# EAGLE design WM-main board1finalRev5_1 (EAGLE 7.5.0)
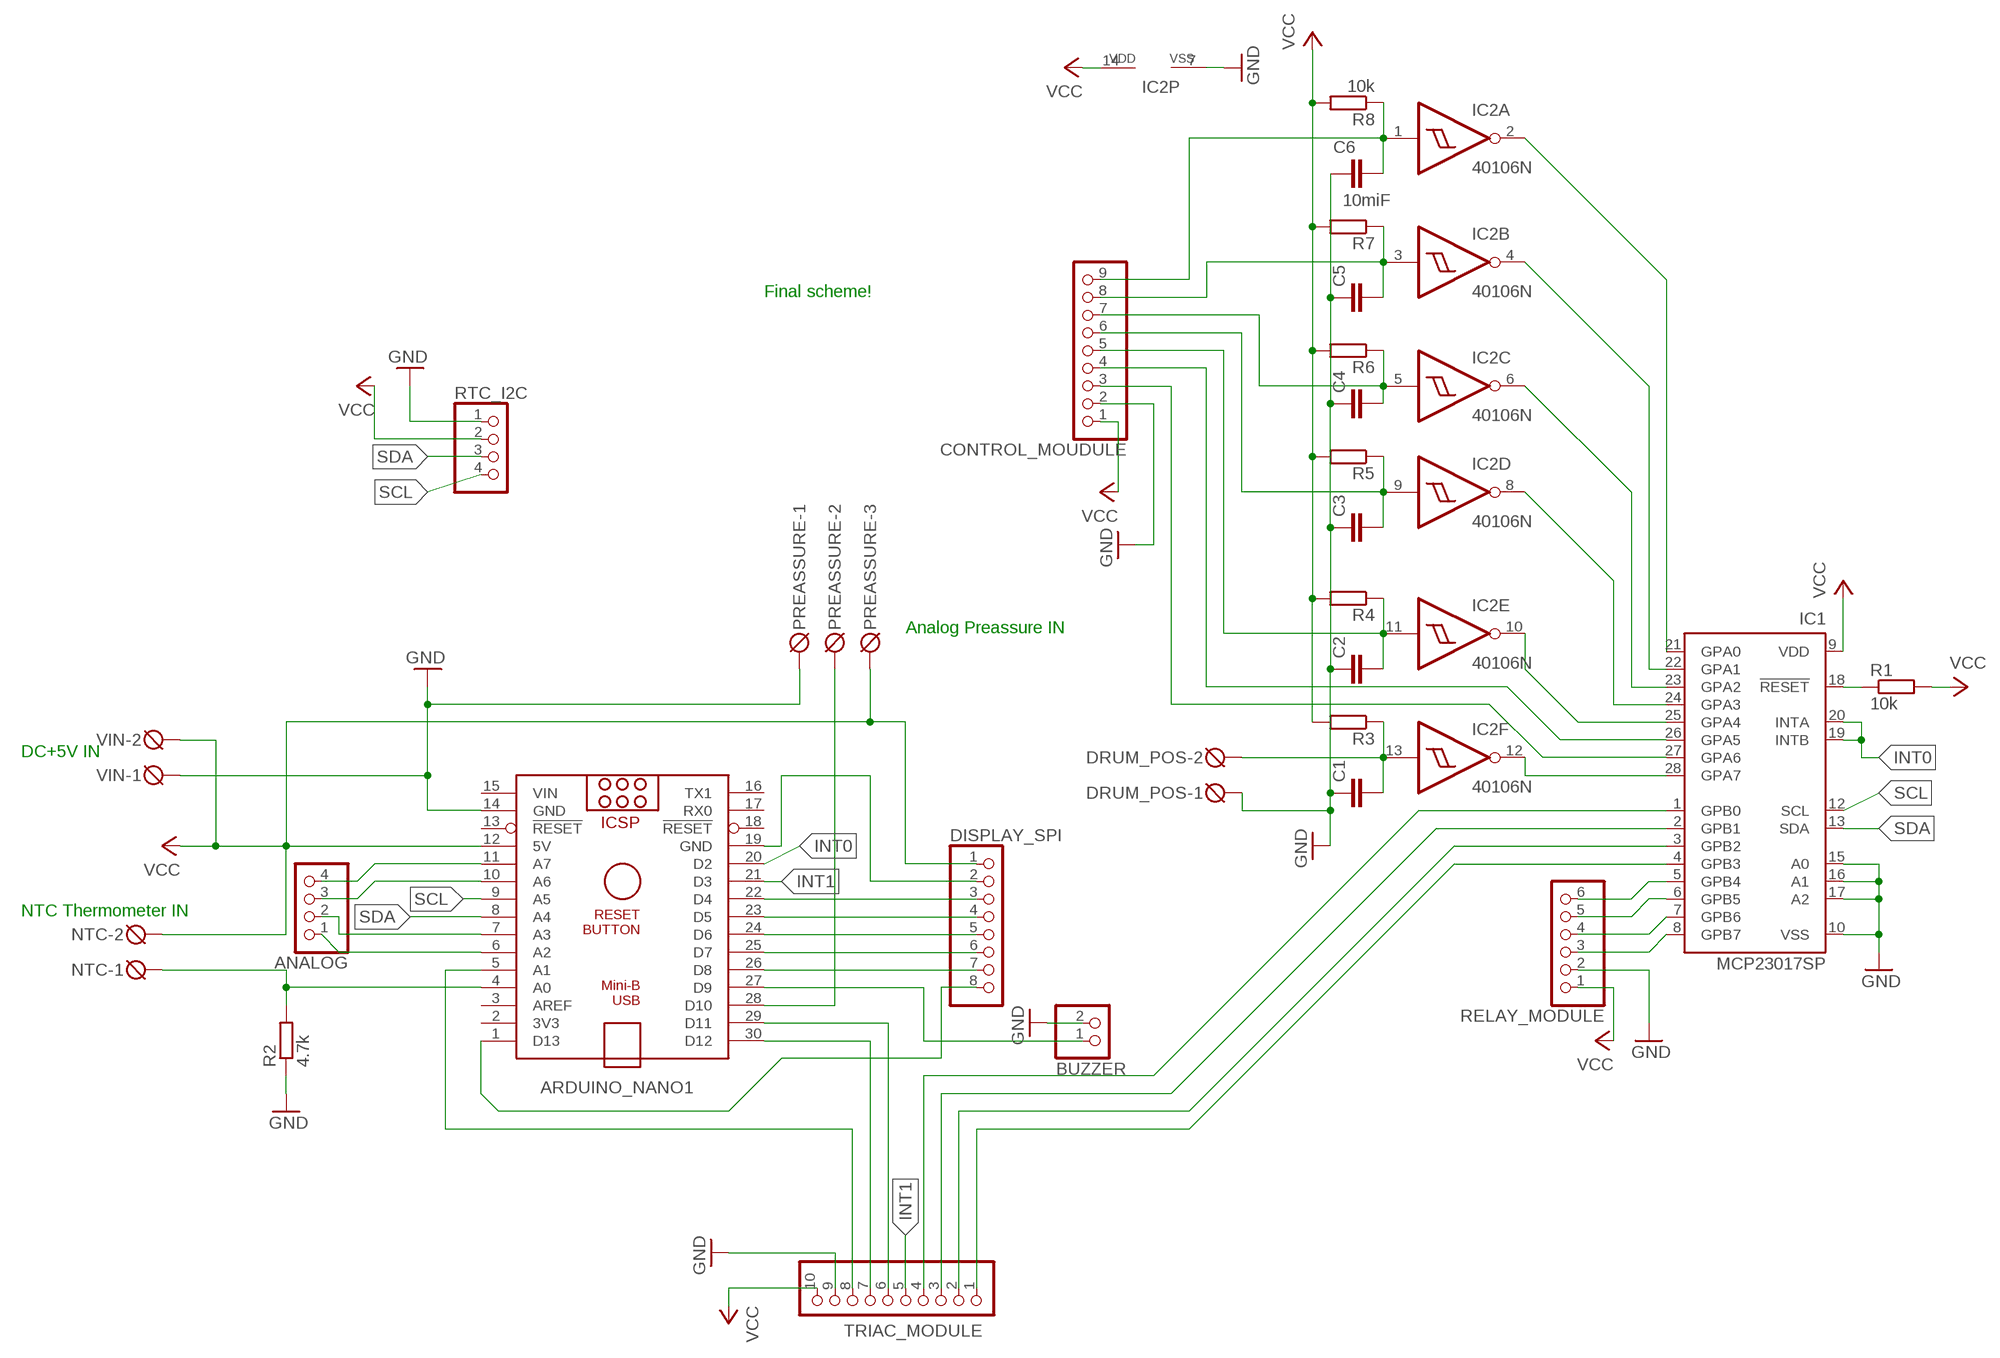
[diagram p0: schematic, sheet 1]

## Parts
ANALOG  PINHD-1X4  [1X04]
ARDUINO_NANO1  ARDUINO_NANO  [ARDUINO_NANO]
BUZZER  PINHD-1X2  [1X02]
C1  CC1206  [C1206]
C2  CC1206  [C1206]
C3  CC1206  [C1206]
C4  CC1206  [C1206]
C5  CC1206  [C1206]
C6  10miF  CC1206  [C1206]
CONTROL_MOUDULE  PINHD-1X9  [1X09-BIG]
DISPLAY_SPI  PINHD-1X8BIG  [1X08-BIG]
DRUM_POS  DRUM  DG3XX-02-5.0  [DG306-5.0-02P]
IC1  MCP23017SP  [DIL28-3]
IC2  40106N  [DIL14]
NTC  TEMP  DG3XX-02-5.0  [DG306-5.0-02P]
PREASSURE  GND D10 +5V(out)  DG3XX-03-5.0  [DG306-5.0-03P]
R1  10k  R-EU_0204/7  [0204/7]
R2  4.7k  R-EU_0204/7  [0204/7]
R3  R-EU_M1206  [M1206]
R4  R-EU_M1206  [M1206]
R5  R-EU_M1206  [M1206]
R6  R-EU_M1206  [M1206]
R7  R-EU_M1206  [M1206]
R8  10k  R-EU_M1206  [M1206]
RELAY_MODULE  PINHD-1X6B  [1X06-BIG]
RTC_I2C  PINHD-1X4  [1X04]
TRIAC_MODULE  PINHD-1X10  [1X10-BIG]
VIN  GND +5V(IN)  DG3XX-02-5.0  [DG306-5.0-02P]

## Nets
GND: ARDUINO_NANO1.14(GND) BUZZER.2 C1.1 C2.1 C3.1 C4.1 C5.1 C6.1 CONTROL_MOUDULE.2 DRUM_POS.1 IC1.10(VSS) IC1.15(A0) IC1.16(A1) IC1.17(A2) IC2.7(P:VSS) PREASSURE.1 R2.1 RELAY_MODULE.2 RTC_I2C.1 TRIAC_MODULE.9 VIN.1
INT0: ARDUINO_NANO1.20(D2) IC1.19(INTB) IC1.20(INTA)
INT1: ARDUINO_NANO1.21(D3) TRIAC_MODULE.5
N$1: IC1.18(!RESET) R1.1
N$2: ARDUINO_NANO1.4(A0) NTC.1 R2.2
N$3: IC1.21(GPA0) IC2.2(A:O)
N$4: IC1.22(GPA1) IC2.4(B:O)
N$5: ARDUINO_NANO1.28(D10) PREASSURE.2
N$6: IC1.23(GPA2) IC2.6(C:O)
N$7: IC1.24(GPA3) IC2.8(D:O)
N$8: IC1.25(GPA4) IC2.10(E:O)
N$9: IC1.28(GPA7) IC2.12(F:O)
N$10: C1.2 DRUM_POS.2 IC2.13(F:I) R3.1
N$11: C2.2 CONTROL_MOUDULE.5 IC2.11(E:I) R4.1
N$12: C3.2 CONTROL_MOUDULE.6 IC2.9(D:I) R5.1
N$13: C4.2 CONTROL_MOUDULE.7 IC2.5(C:I) R6.1
N$14: C5.2 CONTROL_MOUDULE.8 IC2.3(B:I) R7.1
N$15: C6.2 CONTROL_MOUDULE.9 IC2.1(A:I) R8.1
N$16: ANALOG.1 ARDUINO_NANO1.6(A2)
N$17: ARDUINO_NANO1.27(D9) BUZZER.1
N$18: ARDUINO_NANO1.26(D8) DISPLAY_SPI.7
N$19: ARDUINO_NANO1.25(D7) DISPLAY_SPI.6
N$20: ARDUINO_NANO1.24(D6) DISPLAY_SPI.5
N$21: ARDUINO_NANO1.23(D5) DISPLAY_SPI.4
N$22: CONTROL_MOUDULE.4 IC1.26(GPA5)
N$23: ARDUINO_NANO1.22(D4) DISPLAY_SPI.3
N$24: ARDUINO_NANO1.19(GND) DISPLAY_SPI.2
N$25: CONTROL_MOUDULE.3 IC1.27(GPA6)
N$26: IC1.6(GPB5) RELAY_MODULE.5
N$27: ARDUINO_NANO1.29(D11) TRIAC_MODULE.6
N$28: IC1.7(GPB6) RELAY_MODULE.4
N$29: IC1.8(GPB7) RELAY_MODULE.3
N$30: ANALOG.2 ARDUINO_NANO1.7(A3)
N$31: IC1.4(GPB3) TRIAC_MODULE.1
N$32: IC1.1(GPB0) TRIAC_MODULE.4
N$33: IC1.2(GPB1) TRIAC_MODULE.3
N$34: IC1.3(GPB2) TRIAC_MODULE.2
N$36: ARDUINO_NANO1.30(D12) TRIAC_MODULE.7
N$37: ANALOG.3 ARDUINO_NANO1.10(A6)
N$38: ANALOG.4 ARDUINO_NANO1.11(A7)
N$39: IC1.5(GPB4) RELAY_MODULE.6
N$43: ARDUINO_NANO1.1(D13) DISPLAY_SPI.8
N$52: ARDUINO_NANO1.5(A1) TRIAC_MODULE.8
SCL: ARDUINO_NANO1.9(A5) IC1.12(SCL) RTC_I2C.4
SDA: ARDUINO_NANO1.8(A4) IC1.13(SDA) RTC_I2C.3
VCC: ARDUINO_NANO1.12(5V) CONTROL_MOUDULE.1 DISPLAY_SPI.1 IC1.9(VDD) IC2.14(P:VDD) NTC.2 PREASSURE.3 R1.2 R3.2 R4.2 R5.2 R6.2 R7.2 R8.2 RELAY_MODULE.1 RTC_I2C.2 TRIAC_MODULE.10 VIN.2
Unconnected: ARDUINO_NANO1.2(3V3) ARDUINO_NANO1.3(AREF) ARDUINO_NANO1.13(!RESET) ARDUINO_NANO1.16(TX1) ARDUINO_NANO1.17(RX0) ARDUINO_NANO1.18(!RESET)

## Notes on the sheet
- Final scheme!
- Analog Preassure IN
- DC+5V IN
- NTC Thermometer IN

## Power pins joined to a net without a drawn wire
VIN: ARDUINO_NANO1.15(VIN)

## Library data of the parts
ANALOG RTC_I2C = pinhead:PINHD-1X4: PIN HEADER
ARDUINO_NANO1 = ArduinoNanoV30:ARDUINO_NANO: Arduino Nano V3.0 Overview: The Arduino Nano is a small, complete, and breadboard-friendly board based on the ATmega328 (Arduino Nano 3.x) or ATmega168 (Arduino Nano 2.x). It has more or less the same functionality of the Arduino Duemilanove, but in a different package. It lacks only a DC power jack, and works with a Mini-B USB cable instead of a standard one. The Nano was designed and is being produced by Gravitech. Specifications: Microcontroller Atmel ATmega168 or ATmega328 Operating Voltage (logic level) 5 V Input Voltage (recommended) 7-12 V Input Voltage (limits) 6-20 V Digital I/O Pins 14 (of which 6 provide PWM output) Analog Input Pins 8 DC Current per I/O Pin 40 mA Flash Memory 16 KB (ATmega168) or 32 KB (ATmega328) of which 2 KB used by bootloader SRAM 1 KB (ATmega168) or 2 KB (ATmega328) EEPROM 512 bytes (ATmega168) or 1 KB (ATmega328) Clock Speed 16 MHz Dimensions 0.73" x 1.70" Length 45 mm Width 18 mm Weigth 5 g Power: The Arduino Nano can be powered via the Mini-B USB connection, 6-20V unregulated external power supply (pin 30), or 5V regulated external power supply (pin 27). The power source is automatically selected to the highest voltage source. Memory: The ATmega168 has 16 KB of flash memory for storing code (of which 2 KB is used for the bootloader); the ATmega328 has 32 KB, (also with 2 KB used for the bootloader). The ATmega168 has 1 KB of SRAM and 512 bytes of EEPROM (which can be read and written with the EEPROM library); the ATmega328 has 2 KB of SRAM and 1 KB of EEPROM. Input and Output: Each of the 14 digital pins on the Nano can be used as an input or output, using pinMode(), digitalWrite(), and digitalRead() functions. They operate at 5 volts. Each pin can provide or receive a maximum of 40 mA and has an internal pull-up resistor (disconnected by default) of 20-50 kOhms. In addition, some pins have specialized functions. Visit Arduino - ArduinoBoardNano <https://www.arduino.cc/en/Main/ArduinoBoardNano>
BUZZER = pinhead:PINHD-1X2: PIN HEADER
C1-C6 = eagle-ltspice:C: CAPACITOR, European symbol; SPICEMODEL: NONE; SPICEPREFIX: C
CONTROL_MOUDULE = adafruit:PINHD-1X9: Pin header 1x10 0.1" spacing With round pins
DISPLAY_SPI = adafruit:PINHD-1X8: PIN HEADER
DRUM_POS NTC VIN = degson:DG3XX-02: DG350-3.5-02P DG306-5.0-02P
IC1 = adafruit:MCP23017: http://ww1.microchip.com/downloads/en/DeviceDoc/21952a.pdf Source: http://ww1.microchip.com/downloads/en/DeviceDoc/21952a.pdf
IC2 = 40xx:40106: Hex SCHMITT TRIGGER
PREASSURE = degson:DG3XX-03: DG350-3.5-03P DG306-5.0-03P
R1-R8 = resistor:R-EU_: RESISTOR, European symbol
RELAY_MODULE = adafruit:PINHD-1X6: PIN HEADER
TRIAC_MODULE = adafruit:PINHD-1X10: Pin header 1x10 0.1" spacing With round pins

## Net classes
0 default: width 0.762 mm, drill 0.254 mm, clearance 0.508 mm
1 silnější: width 1.016 mm, drill 0.305 mm, clearance 0.635 mm

## Board
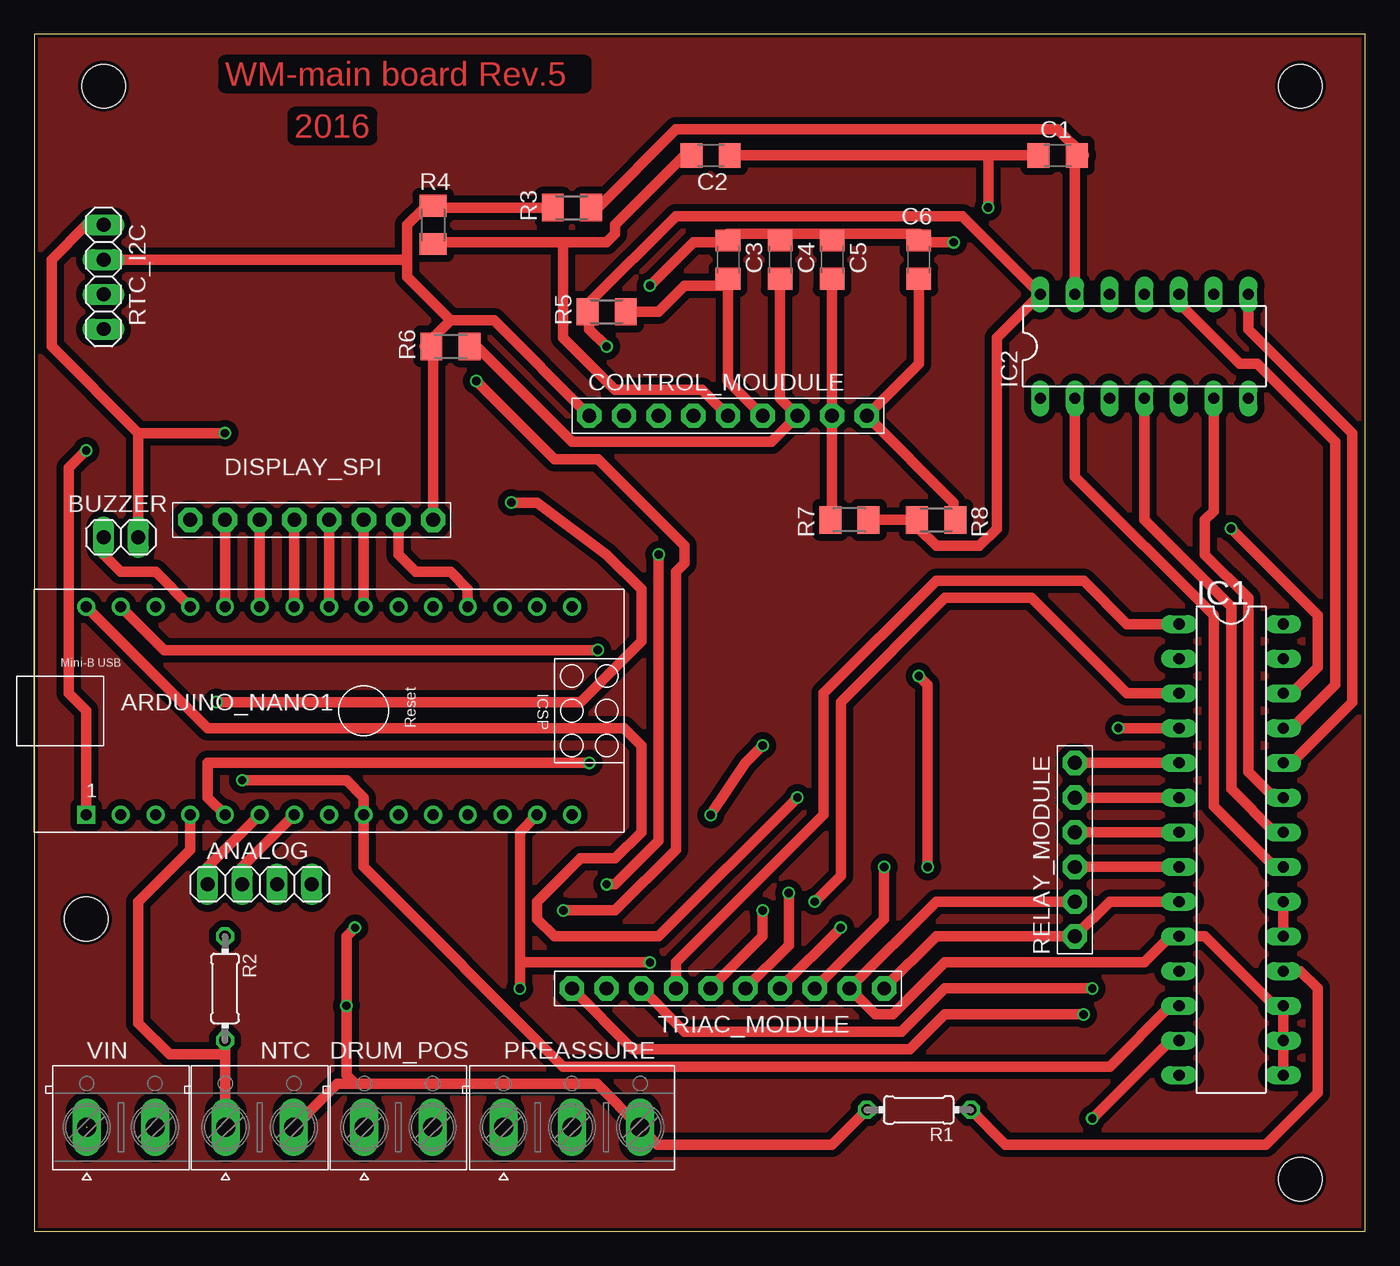
[diagram p1: board, top side]
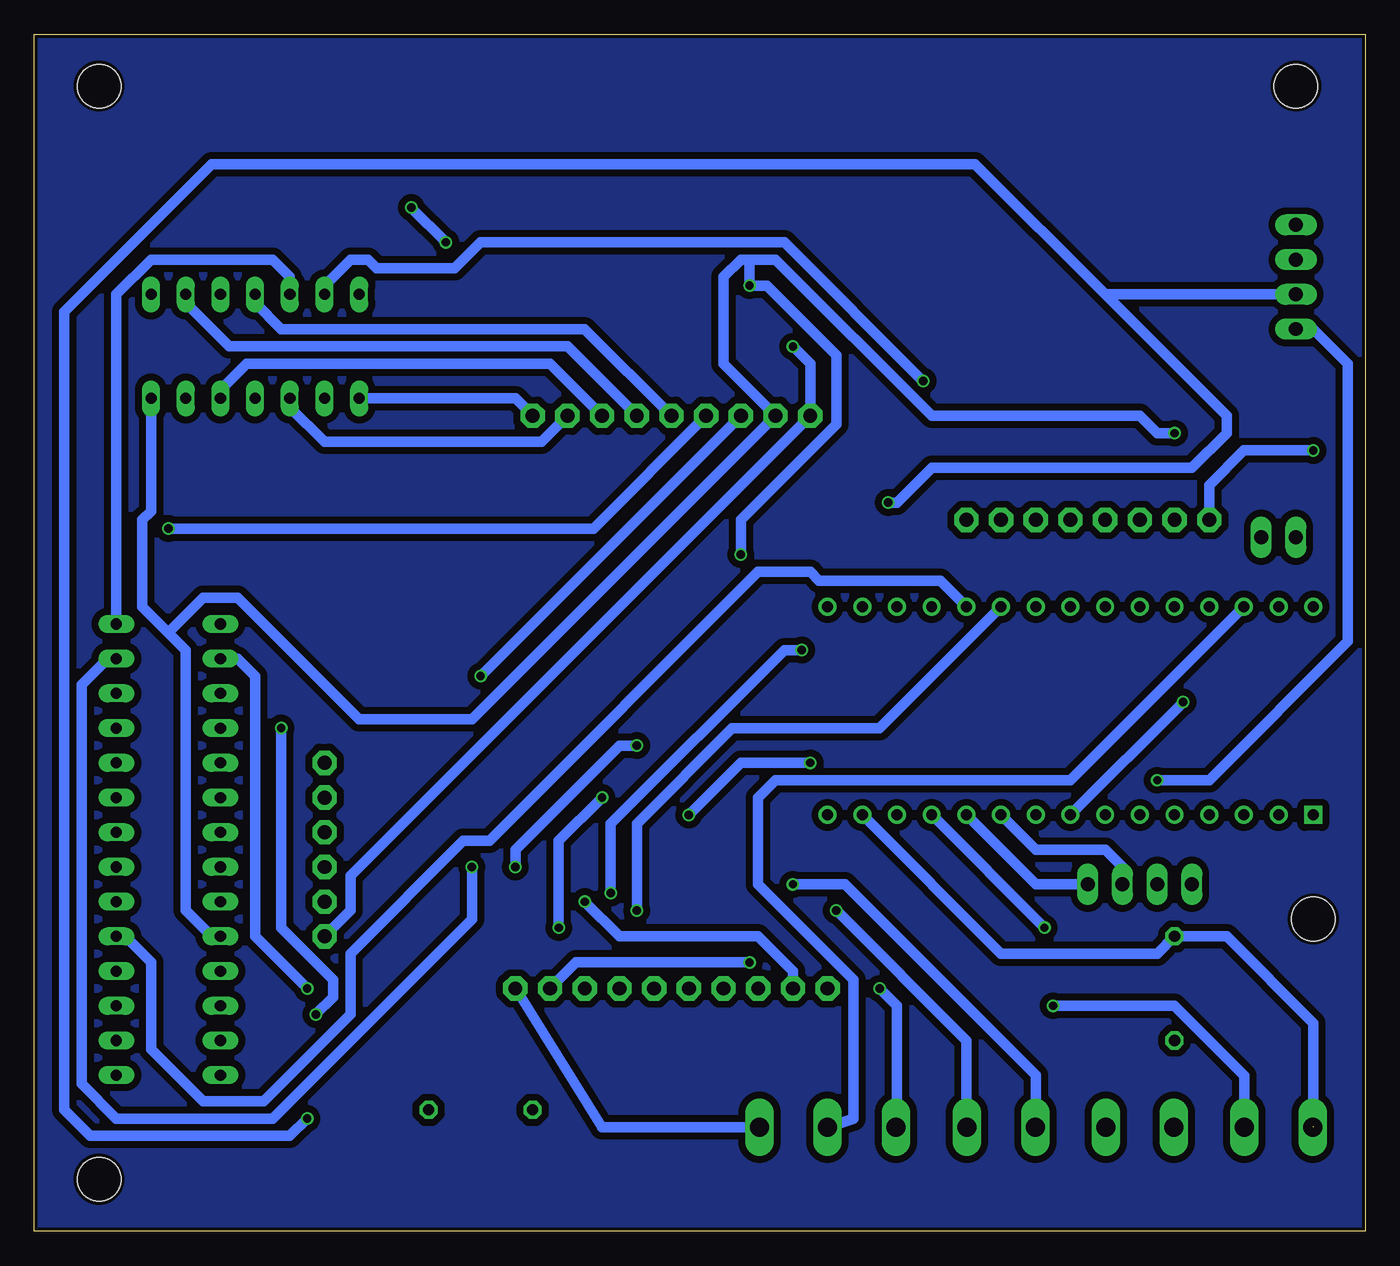
[diagram p2: board, bottom side, seen from below]

Size 97.46 x 87.62 mm. Coordinates in mm from the lower left corner, seen from the top.
Outline: 0,0 97.46,0 97.46,87.62 0,87.62 0,0
Copper layers (1*16): Top 0.035mm / dielectric 1.5mm / Bottom 0.035mm
Design rules "ITead_rule": minimum track width 6mil, minimum drill 12mil, track to track 6mil, track to pad 6mil, pad to pad 6mil, via to via 6mil, smd to smd 0mil, copper to edge 10mil, drill to drill 10mil, minimum pad ring 10mil, minimum via ring 6mil, stop-mask expansion 2mil, vias tented up to drill 100mil, thermal gap 10mil
Holes 3.2 mm at 92.71,83.82 92.71,3.81 3.81,22.86 5.08,83.82

### Footprints (pad centres in the part's own frame; a part is rotated, then mirrored left to right if it is on the bottom)
1X04 = drill 1.016 long: 1 -3.81,0; 2 -1.27,0; 3 1.27,0; 4 3.81,0
ARDUINO_NANO = drill 0.8 square: 1 -20.32,-7.62 | drill 0.8: 2 -17.78,-7.62; 3 -15.24,-7.62; 4 -12.7,-7.62; 5 -10.16,-7.62; 6 -7.62,-7.62; 7 -5.08,-7.62; 8 -2.54,-7.62; 9 0,-7.62; 10 2.54,-7.62; 11 5.08,-7.62; 12 7.62,-7.62; 13 10.16,-7.62; 14 12.7,-7.62; 15 15.24,-7.62; 16 15.24,7.62; 17 12.7,7.62; 18 10.16,7.62; 19 7.62,7.62; 20 5.08,7.62; 21 2.54,7.62; 22 0,7.62; 23 -2.54,7.62; 24 -5.08,7.62; 25 -7.62,7.62; 26 -10.16,7.62; 27 -12.7,7.62; 28 -15.24,7.62; 29 -17.78,7.62; 30 -20.32,7.62
1X02 = drill 1.016 long: 1 -1.27,0; 2 1.27,0
C1206 = smd 1.6 x 1.8: 1 -1.4,0; 2 1.4,0
1X09-BIG = drill 1.016 pad 1.778 octagon: 1 -10.16,0; 2 -7.62,0; 3 -5.08,0; 4 -2.54,0; 5 0,0; 6 2.54,0; 7 5.08,0; 8 7.62,0; 9 10.16,0
1X08-BIG = drill 1.016 pad 1.778 octagon: 1 -8.89,0; 2 -6.35,0; 3 -3.81,0; 4 -1.27,0; 5 1.27,0; 6 3.81,0; 7 6.35,0; 8 8.89,0
DG306-5.0-02P = drill 1.4 long: 1 -2.5,0; 2 2.5,0
DIL28-3 = drill 0.813 long: 1 -16.51,-3.81; 2 -13.97,-3.81; 3 -11.43,-3.81; 4 -8.89,-3.81; 5 -6.35,-3.81; 6 -3.81,-3.81; 7 -1.27,-3.81; 8 1.27,-3.81; 9 3.81,-3.81; 10 6.35,-3.81; 11 8.89,-3.81; 12 11.43,-3.81; 13 13.97,-3.81; 14 16.51,-3.81; 15 16.51,3.81; 16 13.97,3.81; 17 11.43,3.81; 18 8.89,3.81; 19 6.35,3.81; 20 3.81,3.81; 21 1.27,3.81; 22 -1.27,3.81; 23 -3.81,3.81; 24 -6.35,3.81; 25 -8.89,3.81; 26 -11.43,3.81; 27 -13.97,3.81; 28 -16.51,3.81
DIL14 = drill 0.813 long: 1 -7.62,-3.81; 2 -5.08,-3.81; 3 -2.54,-3.81; 4 0,-3.81; 5 2.54,-3.81; 6 5.08,-3.81; 7 7.62,-3.81; 8 7.62,3.81; 9 5.08,3.81; 10 2.54,3.81; 11 0,3.81; 12 -2.54,3.81; 13 -5.08,3.81; 14 -7.62,3.81
DG306-5.0-03P = drill 1.4 long: 1 -5,0; 2 0,0; 3 5,0
0204/7 = drill 0.813 octagon: 1 -3.81,0; 2 3.81,0
M1206 = smd 1.6 x 2: 1 -1.4,0; 2 1.4,0
1X06-BIG = drill 1.016 pad 1.778 octagon: 1 -6.35,0; 2 -3.81,0; 3 -1.27,0; 4 1.27,0; 5 3.81,0; 6 6.35,0
1X10-BIG = drill 1.016 pad 1.778 octagon: 1 -11.43,0; 2 -8.89,0; 3 -6.35,0; 4 -3.81,0; 5 -1.27,0; 6 1.27,0; 7 3.81,0; 8 6.35,0; 9 8.89,0; 10 11.43,0

### Placement (x,y rotation side)
ANALOG  16.51,25.4 0 top
ARDUINO_NANO1  24.13,38.1 0 top
BUZZER  6.35,50.8 0 top
C1  74.93,78.74 0 top
C2  49.53,78.74 180 top
C3  50.8,71.12 270 top
C4  54.61,71.12 270 top
C5  58.42,71.12 270 top
C6  64.77,71.12 270 top
CONTROL_MOUDULE  50.8,59.69 0 top
DISPLAY_SPI  20.32,52.07 180 top
DRUM_POS  26.67,7.62 0 top
IC1  87.63,27.94 270 top
IC2  81.28,64.77 0 top
NTC  16.51,7.62 0 top
PREASSURE  39.37,7.62 0 top
R1  64.77,8.89 180 top
R2  13.97,17.78 270 top
R3  39.37,74.93 180 top
R4  29.21,73.66 90 top
R5  41.91,67.31 180 top
R6  30.48,64.77 180 top
R7  59.69,52.07 0 top
R8  66.04,52.07 180 top
RELAY_MODULE  76.2,27.94 90 top
RTC_I2C  5.08,69.85 270 top
TRIAC_MODULE  50.8,17.78 0 top
VIN  6.35,7.62 0 top

### Tracks (layer width: path | path; a pad name or v marks a point on that pad's centre or on a via)
GND  (via drill 0.6, 0.61)  (1 unrouted)
  Top 0.762: 35.56,19.68 35.56,29.21 ARDUINO_NANO1.14 | 35.56,19.68 v35.56,17.78 | RELAY_MODULE.2 66.04,24.13 TRIAC_MODULE.9 61.59,15.88 62.87,15.88 66.67,19.68 81.28,19.68 83.19,21.59 IC1.10 85.72,21.59 90.81,16.51 IC1.17 IC1.16 IC1.15 | v45.09,19.68 35.56,19.68 | C1.1 69.85,78.74 | 69.85,78.74 C2.1 | 54.61,73.03 50.8,73.03 C3.1 50.8,72.39 48.26,72.39 v45.09,69.22 | 54.61,73.03 58.42,73.03 | 54.61,73.03 C4.1 | 58.42,73.03 64.77,73.03 C6.1 64.77,72.39 v67.31,72.39 | 58.42,73.03 C5.1 | v41.91,25.4 42.55,25.4 45.72,28.57 v45.72,49.53 | v69.85,74.93 69.85,78.74 | RTC_I2C.1 3.81,73.66 1.27,71.12 1.27,64.77 7.62,58.42 | 7.62,58.42 BUZZER.2 | 7.62,58.42 v13.97,58.42
  Bottom 0.406: 43.81,71.12 45.09,71.12 | 24.13,7.66 DRUM_POS.1 | 34.29,7.7 PREASSURE.1
  Bottom 0.762: ARDUINO_NANO1.14 26.67,20.32 15.24,20.32 R2.1 10.16,21.59 3.81,15.24 3.81,7.66 | IC2.7 88.9,52.7 89.53,52.07 89.53,45.72 87.63,43.81 | 87.63,43.81 86.36,42.55 86.36,23.5 84.45,21.59 IC1.10 | 87.63,43.81 85.09,46.35 82.55,46.35 73.66,37.47 65.41,37.47 CONTROL_MOUDULE.2 46.99,63.5 46.99,69.85 45.72,71.12 43.81,71.12 43.18,71.12 31.75,59.69 16.51,59.69 15.24,58.42 v13.97,58.42 | v45.09,19.68 57.78,19.68 TRIAC_MODULE.9 | v41.91,25.4 38.1,25.4 24.13,11.43 24.13,7.66 | v45.72,49.53 45.72,52.07 38.73,59.05 38.73,64.14 43.81,69.22 v45.09,69.22 45.09,71.12 | v67.31,72.39 v69.85,74.93 | v35.56,17.78 34.29,16.51 34.29,7.7
INT0
  Top 0.762: IC1.19 IC1.20
  Bottom 0.762: ARDUINO_NANO1.20 31.11,47.62 40.01,47.62 40.64,48.26 44.45,48.26 64.14,28.57 66.04,28.57 74.3,20.32 74.3,15.88 80.64,9.53 85.09,9.53 88.9,13.34 88.9,19.68 90.81,21.59 IC1.19
INT1  (via drill 0.61)
  Top 0.762: v53.34,23.5 53.34,21.59 TRIAC_MODULE.5
  Bottom 0.762: ARDUINO_NANO1.21 35.56,36.83 46.35,36.83 53.34,29.84 v53.34,23.5
N$1
  Top 0.762: R1.1 71.12,6.35 90.17,6.35 93.98,10.16 93.98,17.78 92.71,19.05 IC1.18
N$2
  Top 0.762: 13.97,12.95 R2.2 | 13.97,12.95 9.91,12.95 7.62,15.24 7.62,24.13 11.43,27.94 ARDUINO_NANO1.4 | 13.97,12.95 13.97,7.66 NTC.1
N$3
  Top 0.762: IC2.2 76.2,55.24 86.36,45.09 86.36,31.11 90.81,26.67 IC1.21
N$4
  Top 0.762: IC2.4 81.28,52.07 87.63,45.72 87.63,32.38 90.81,29.21 IC1.22
N$5
  Bottom 0.762: ARDUINO_NANO1.28 21.59,33.02 43.18,33.02 44.45,31.75 44.45,25.4 37.47,18.41 37.47,8.26 PREASSURE.2
N$6
  Top 0.762: IC2.6 86.36,52.7 85.72,52.07 85.72,49.53 88.9,46.35 88.9,33.66 90.81,31.75 IC1.23
N$7
  Top 0.762: IC2.8 88.9,66.04 96.52,58.42 96.52,38.73 92.08,34.29 IC1.24
N$8
  Top 0.762: IC2.10 83.82,67.94 88.27,63.5 89.53,63.5 95.25,57.78 95.25,40.01 92.08,36.83 IC1.25
N$9
  Bottom 0.762: IC1.28 91.44,68.58 88.9,71.12 80.01,71.12 78.74,69.85 IC2.12
N$10  (via drill 0.61)
  Top 0.762: IC2.13 76.2,78.74 C1.2 76.83,78.74 74.93,80.64 46.99,80.64 41.27,74.93 R3.1 | v38.73,23.5 42.55,23.5 46.99,27.94 46.99,48.26 47.62,48.9 47.62,50.16 41.27,56.52 38.1,56.52 v32.38,62.23
  Bottom 0.406: 29.21,7.66 DRUM_POS.2
  Bottom 0.762: v38.73,23.5 29.21,13.97 29.21,7.66 | v32.38,62.23 42.55,72.39 64.77,72.39 66.67,70.48 72.39,70.48 73.03,71.12 74.3,71.12 76.2,69.22 IC2.13
N$11
  Top 0.762: 38.73,72.39 29.21,72.39 R4.1 | 38.73,72.39 41.91,72.39 42.55,73.03 42.55,73.66 47.62,78.74 C2.2 | 38.73,72.39 38.73,65.41 42.55,61.59 48.9,61.59 CONTROL_MOUDULE.5
  Bottom 0.762: IC2.11 81.28,67.94 79.38,66.04 57.15,66.04 CONTROL_MOUDULE.5
N$12
  Top 0.762: 50.8,69.22 47.62,69.22 45.72,67.31 R5.1 | 50.8,69.22 50.8,62.23 CONTROL_MOUDULE.6 | 50.8,69.22 C3.2
  Bottom 0.762: IC2.9 86.36,67.94 83.19,64.77 58.42,64.77 CONTROL_MOUDULE.6
N$13
  Top 0.762: C4.2 54.61,60.96 CONTROL_MOUDULE.7 53.98,57.78 39.37,57.78 32.38,64.77 R6.1
  Bottom 0.762: IC2.5 83.82,61.59 81.92,63.5 59.69,63.5 CONTROL_MOUDULE.7
N$14
  Top 0.762: 58.67,69.34 C5.2 CONTROL_MOUDULE.8 58.42,52.07 R7.1
  Bottom 0.762: IC2.3 78.74,60.33 76.2,57.78 60.33,57.78 CONTROL_MOUDULE.8
N$15
  Top 0.762: C6.2 64.77,63.5 CONTROL_MOUDULE.9 67.31,53.34 67.31,52.07 R8.1
  Bottom 0.762: IC2.1 62.23,60.96 CONTROL_MOUDULE.9
N$16
  Top 0.762: ARDUINO_NANO1.6 12.7,26.67 ANALOG.1
N$17
  Top 0.762: ARDUINO_NANO1.27 8.89,48.26 6.35,48.26 5.08,49.53 BUZZER.1
N$18
  Top 0.762: DISPLAY_SPI.7 ARDUINO_NANO1.26
N$19
  Top 0.762: DISPLAY_SPI.6 ARDUINO_NANO1.25
N$20
  Top 0.762: DISPLAY_SPI.5 ARDUINO_NANO1.24
N$21
  Top 0.762: DISPLAY_SPI.4 ARDUINO_NANO1.23
N$22  (via drill 0.61)
  Top 0.762: IC1.26 92.08,39.37 93.98,41.27 93.98,45.09 v87.63,51.44
  Bottom 0.762: v87.63,51.44 56.52,51.44 CONTROL_MOUDULE.4
N$23
  Top 0.762: DISPLAY_SPI.3 ARDUINO_NANO1.22
N$24
  Top 0.762: ARDUINO_NANO1.19 31.75,46.99 30.48,48.26 27.94,48.26 26.67,49.53 DISPLAY_SPI.2
N$25  (via drill 0.6, 0.61)
  Top 0.762: v65.41,26.67 65.41,40.01 v64.77,40.64
  Bottom 0.762: IC1.27 92.08,41.91 93.98,40.01 93.98,10.79 91.44,8.26 80.01,8.26 65.41,22.86 v65.41,26.67 | CONTROL_MOUDULE.3 v64.77,40.64
N$26
  Top 0.762: RELAY_MODULE.5 IC1.6
N$27  (via drill 0.61)
  Top 0.762: ARDUINO_NANO1.29 9.53,42.55 v41.27,42.55 | v55.24,24.77 55.24,20.95 TRIAC_MODULE.6
  Bottom 0.762: v41.27,42.55 42.55,42.55 55.24,29.84 v55.24,24.77
N$28
  Top 0.762: RELAY_MODULE.4 IC1.7
N$29
  Top 0.762: RELAY_MODULE.3 IC1.8
N$30
  Top 0.762: ARDUINO_NANO1.7 15.24,26.67 ANALOG.2
N$31  (via drill 0.61)
  Top 0.762: v76.83,15.88 66.67,15.88 64.14,13.34 43.81,13.34 TRIAC_MODULE.1 | v79.38,36.83 IC1.4
  Bottom 0.762: v76.83,15.88 75.56,17.14 75.56,18.41 79.38,22.23 v79.38,36.83
N$32
  Top 0.762: TRIAC_MODULE.4 46.99,19.68 57.78,30.48 57.78,39.37 66.04,47.62 76.83,47.62 80.01,44.45 IC1.1
N$33  (via drill 0.61)
  Top 0.762: v77.47,17.78 66.67,17.78 63.5,14.61 47.62,14.61 TRIAC_MODULE.3
  Bottom 0.762: v77.47,17.78 81.28,21.59 81.28,40.64 82.55,41.91 IC1.2
N$34  (via drill 0.61)
  Top 0.762: v57.15,24.13 59.05,26.04 59.05,38.73 66.67,46.35 73.03,46.35 80.01,39.37 IC1.3
  Bottom 0.762: v57.15,24.13 54.61,21.59 44.45,21.59 41.91,19.05 TRIAC_MODULE.2
N$36  (via drill 0.61)
  Top 0.762: ARDUINO_NANO1.30 12.7,36.83 43.18,36.83 44.45,35.56 44.45,29.21 42.55,27.3 40.01,27.3 36.83,24.13 36.83,22.86 38.1,21.59 45.72,21.59 v55.88,31.75 | TRIAC_MODULE.7 v59.05,22.23
  Bottom 0.762: v55.88,31.75 59.05,28.57 v59.05,22.23
N$37
  Bottom 0.762: ANALOG.3 17.78,26.67 19.05,27.94 24.13,27.94 ARDUINO_NANO1.10
N$38
  Bottom 0.762: ANALOG.4 24.13,25.4 ARDUINO_NANO1.11
N$39
  Top 0.762: RELAY_MODULE.6 IC1.5
N$40  (via drill 0.6)
  other vias: 64.77,40.64
N$41
  pour Top: 0,87.63 0,0 97.79,0 97.79,87.63
N$42
  pour Bottom: 0,87.63 0,0 97.79,0 97.79,87.63
N$43  (via drill 0.6)
  Top 0.762: ARDUINO_NANO1.1 3.81,38.1 2.54,39.37 2.54,55.88 v3.81,57.15
  Bottom 0.762: v3.81,57.15 8.89,57.15 11.43,54.61 DISPLAY_SPI.8
N$45  (via drill 0.6)
  other vias: 13.97,58.42
N$46  (via drill 0.6)
  other vias: 15.24,33.02
N$49  (via drill 0.6)
  other vias: 40.64,34.29
N$50  (via drill 0.6)
  other vias: 49.53,30.48
N$51  (via drill 0.6)
  other vias: 53.34,35.56
N$52  (via drill 0.6)
  Top 0.762: ARDUINO_NANO1.5 12.7,31.75 12.7,34.29 v40.64,34.29 | v49.53,30.48 52.07,34.29 v53.34,35.56 | v62.23,26.67 62.23,22.86 TRIAC_MODULE.8
  Bottom 0.762: v40.64,34.29 45.72,34.29 v49.53,30.48 | v53.34,35.56 54.61,35.56 62.23,27.94 v62.23,26.67
N$53  (via drill 0.6)
  other vias: 62.23,26.67
N$54  (via drill 0.6)
  other vias: 3.81,57.15
S$1  (via drill 0.61)
  other vias: 22.86,16.51
SCL  (via drill 0.6)
  Top 0.762: IC1.12 83.19,16.51 78.74,12.06 38.73,12.06 24.13,26.67 ARDUINO_NANO1.9 24.13,31.75 22.86,33.02 v15.24,33.02
  Bottom 0.762: v15.24,33.02 11.43,33.02 1.27,43.18 1.27,63.5 3.81,66.04 RTC_I2C.4
SDA  (via drill 0.61)
  Top 0.762: v13.34,38.73 40.01,38.73 44.45,43.18 44.45,46.99 41.91,49.53 36.83,53.34 v34.92,53.34 | v77.47,8.26 83.19,13.97 IC1.13
  Bottom 0.762: v13.34,38.73 ARDUINO_NANO1.8 | v77.47,8.26 78.74,6.99 93.34,6.99 95.25,8.89 95.25,67.31 84.45,78.11 28.57,78.11 19.05,68.58 | 19.05,68.58 10.16,59.69 10.16,58.42 12.7,55.88 31.75,55.88 34.29,53.34 v34.92,53.34 | RTC_I2C.3 19.05,68.58
VCC  (via drill 0.6, 0.61)
  Top 0.762: R3.2 29.21,74.93 | DISPLAY_SPI.1 29.21,64.77 R6.2 28.57,64.77 30.48,66.67 | CONTROL_MOUDULE.1 33.66,66.67 30.48,66.67 | 29.21,74.93 28.57,74.93 27.3,73.66 27.3,71.12 | 27.3,71.12 27.3,69.85 30.48,66.67 | 29.21,74.93 R4.2 | R7.2 R8.2 64.77,52.07 64.77,51.44 66.04,50.16 69.22,50.16 70.48,51.44 70.48,65.41 IC2.14 67.94,74.3 46.99,74.3 40.64,67.94 40.64,67.31 | v41.91,64.77 40.64,66.04 40.64,67.31 | 40.64,67.31 R5.2 | IC1.9 78.74,24.13 RELAY_MODULE.1 66.04,21.59 TRIAC_MODULE.10 | 23.5,10.79 41.2,10.79 PREASSURE.3 45.64,6.35 58.42,6.35 R1.2 | 23.5,10.79 22.86,11.43 v22.86,16.51 22.86,21.59 v23.5,22.23 | 23.5,10.79 22.18,10.79 NTC.2 | RTC_I2C.2 27.3,71.12
  Bottom 0.508: 76.45,21.59 RELAY_MODULE.1
  Bottom 0.762: v41.91,64.77 40.64,63.5 CONTROL_MOUDULE.1 74.3,26.04 74.3,23.5 RELAY_MODULE.1 | v23.5,22.23 ARDUINO_NANO1.12 | TRIAC_MODULE.10 55.88,7.62 PREASSURE.3 | VIN.2 8.85,11.39 13.97,16.51 v22.86,16.51

### Text on the board
Top: WM-main board Rev.5 | 2016